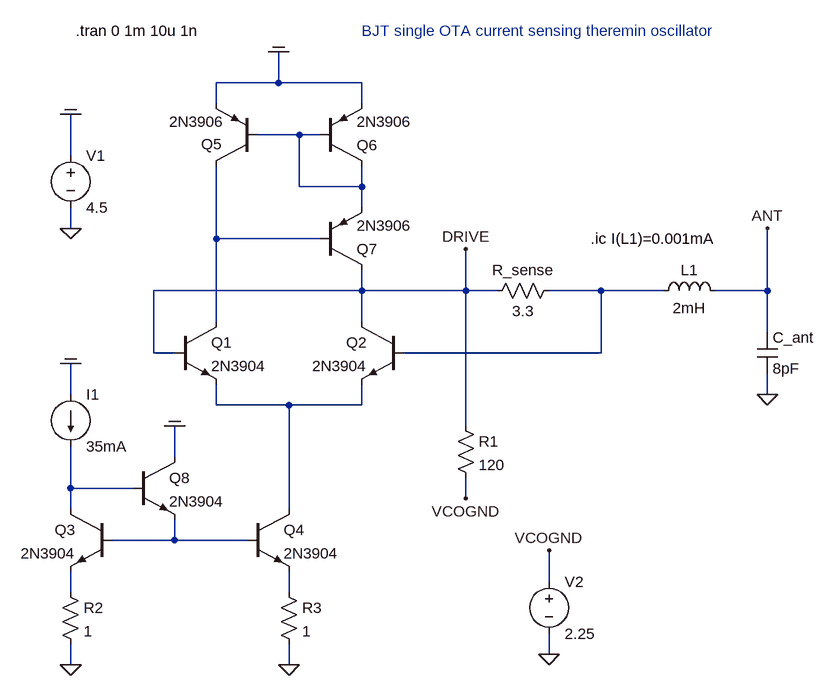
[diagram p0: schematic bjt_current_sensing_oscillator_ota.asc]
bjt_current_sensing_oscillator_ota.asc, the LTspice schematic file:
Version 4
SHEET 1 4500 1880
WIRE 912 -64 912 -112
WIRE 912 -64 816 -64
WIRE 1040 -64 912 -64
WIRE 816 -32 816 -64
WIRE 1040 -32 1040 -64
WIRE 944 16 880 16
WIRE 976 16 944 16
WIRE 592 48 592 -16
WIRE 944 96 944 16
WIRE 1040 96 1040 64
WIRE 1040 96 944 96
WIRE 1040 128 1040 96
WIRE 592 160 592 128
WIRE 816 176 816 64
WIRE 976 176 816 176
WIRE 1040 256 1040 224
WIRE 1040 256 720 256
WIRE 1200 256 1200 192
WIRE 1200 256 1040 256
WIRE 1248 256 1200 256
WIRE 1408 256 1328 256
WIRE 1504 256 1408 256
WIRE 1664 256 1664 160
WIRE 1664 256 1584 256
WIRE 816 304 816 176
WIRE 1040 304 1040 256
WIRE 1664 320 1664 256
WIRE 720 352 720 256
WIRE 752 352 720 352
WIRE 1408 352 1408 256
WIRE 1408 352 1104 352
WIRE 592 416 592 368
WIRE 1664 416 1664 384
WIRE 816 432 816 400
WIRE 928 432 816 432
WIRE 1040 432 1040 400
WIRE 1040 432 928 432
WIRE 1200 464 1200 256
WIRE 752 512 752 464
WIRE 592 560 592 496
WIRE 688 560 592 560
WIRE 1200 576 1200 544
WIRE 592 592 592 560
WIRE 928 592 928 432
WIRE 752 640 752 608
WIRE 752 640 656 640
WIRE 864 640 752 640
WIRE 1328 704 1328 656
WIRE 592 720 592 688
WIRE 928 720 928 688
WIRE 1328 816 1328 784
WIRE 592 832 592 800
WIRE 928 832 928 800
FLAG 928 832 0
FLAG 592 832 0
FLAG 592 368 COM
FLAG 1664 416 0
FLAG 1664 160 ANT
FLAG 1200 576 VCOGND
FLAG 1328 816 0
FLAG 1328 656 VCOGND
FLAG 592 160 0
FLAG 592 -16 COM
FLAG 912 -112 COM
FLAG 752 464 COM
FLAG 1200 192 DRIVE
SYMBOL npn 1104 304 M0
SYMATTR InstName Q2
SYMATTR Value 2N3904
SYMBOL npn 752 304 R0
SYMATTR InstName Q1
SYMATTR Value 2N3904
SYMBOL pnp 976 64 M180
SYMATTR InstName Q6
SYMATTR Value 2N3906
SYMBOL pnp 880 64 R180
WINDOW 0 55 34 Left 2
WINDOW 3 52 68 Left 2
SYMATTR InstName Q5
SYMATTR Value 2N3906
SYMBOL npn 864 592 R0
SYMATTR InstName Q4
SYMATTR Value 2N3904
SYMBOL npn 656 592 M0
SYMATTR InstName Q3
SYMATTR Value 2N3904
SYMBOL current 592 416 R0
WINDOW 123 0 0 Left 0
WINDOW 39 0 0 Left 0
SYMATTR InstName I1
SYMATTR Value 35mA
SYMBOL res 576 704 R0
WINDOW 0 36 40 Left 2
WINDOW 3 36 76 Left 2
SYMATTR InstName R2
SYMATTR Value 1
SYMBOL res 912 704 R0
WINDOW 0 36 40 Left 2
WINDOW 3 36 76 Left 2
SYMATTR InstName R3
SYMATTR Value 1
SYMBOL ind 1488 272 R270
WINDOW 0 32 56 VTop 2
WINDOW 3 5 56 VBottom 2
SYMATTR InstName L1
SYMATTR Value 2mH
SYMATTR SpiceLine Ipk=100m Rser=20 Rpar=10Meg Cpar=1pF
SYMBOL cap 1648 320 R0
SYMATTR InstName C_ant
SYMATTR Value 8pF
SYMBOL res 1344 240 R90
WINDOW 0 0 56 VBottom 2
WINDOW 3 32 56 VTop 2
SYMATTR InstName R_sense
SYMATTR Value 3.3
SYMBOL res 1184 448 R0
WINDOW 0 36 40 Left 2
WINDOW 3 36 76 Left 2
SYMATTR InstName R1
SYMATTR Value 120
SYMBOL voltage 1328 688 R0
WINDOW 123 0 0 Left 0
WINDOW 39 0 0 Left 0
SYMATTR InstName V2
SYMATTR Value 2.25
SYMBOL voltage 592 32 R0
WINDOW 123 0 0 Left 0
WINDOW 39 0 0 Left 0
SYMATTR InstName V1
SYMATTR Value 4.5
SYMBOL pnp 976 224 M180
SYMATTR InstName Q7
SYMATTR Value 2N3906
SYMBOL npn 688 512 R0
SYMATTR InstName Q8
SYMATTR Value 2N3904
TEXT 600 -144 Left 2 !.tran 0 1m 10u 1n
TEXT 1392 176 Left 2 !.ic I(L1)=0.001mA
TEXT 1040 -144 Left 2 ;BJT single OTA current sensing theremin oscillator

The netlist it stands for:
* bjt_current_sensing_oscillator_ota.asc
Q2 DRIVE N003 N004 0 2N3904
Q1 N002 DRIVE N004 0 2N3904
Q6 N001 N001 COM 0 2N3906
Q5 N002 N001 COM 0 2N3906
Q4 N004 N006 N008 0 2N3904
Q3 N005 N006 N007 0 2N3904
I1 COM N005 35mA
R2 N007 0 1
R3 N008 0 1
L1 N003 ANT 2mH Ipk=100m Rser=20 Rpar=10Meg Cpar=1pF
C_ant ANT 0 8pF
R_sense N003 DRIVE 3.3
R1 DRIVE VCOGND 120
V2 VCOGND 0 2.25
V1 COM 0 4.5
Q7 DRIVE N002 N001 0 2N3906
Q8 COM N005 N006 0 2N3904
.model NPN NPN
.model PNP PNP
.lib standard.bjt
.tran 0 1m 10u 1n
.ic I(L1)=0.001mA
* BJT single OTA current sensing theremin oscillator
.backanno
.end